# Altium schematic sheet WR-Clocks.SchDoc: =SheetTitle_Top
size 420 x 297 mm; EDA_Number: ARTIQ; Author: G.Kasprowicz; CompanyName: WUT ISE; DrawnBy: G.Kasprowicz; Organization: WUT ISE; Address1: PW ISE; Address2: Nowowiejska 15/19 00-665 Warsaw; Address3: gkasprow@gmail.com; ModifiedBy: -; CheckedDate: -; Title2: WR Clocks; DivGrp: WUT ISE; Designer: G.Kasprowicz; ModifiedDate: -; ProjectName: Sensor Box
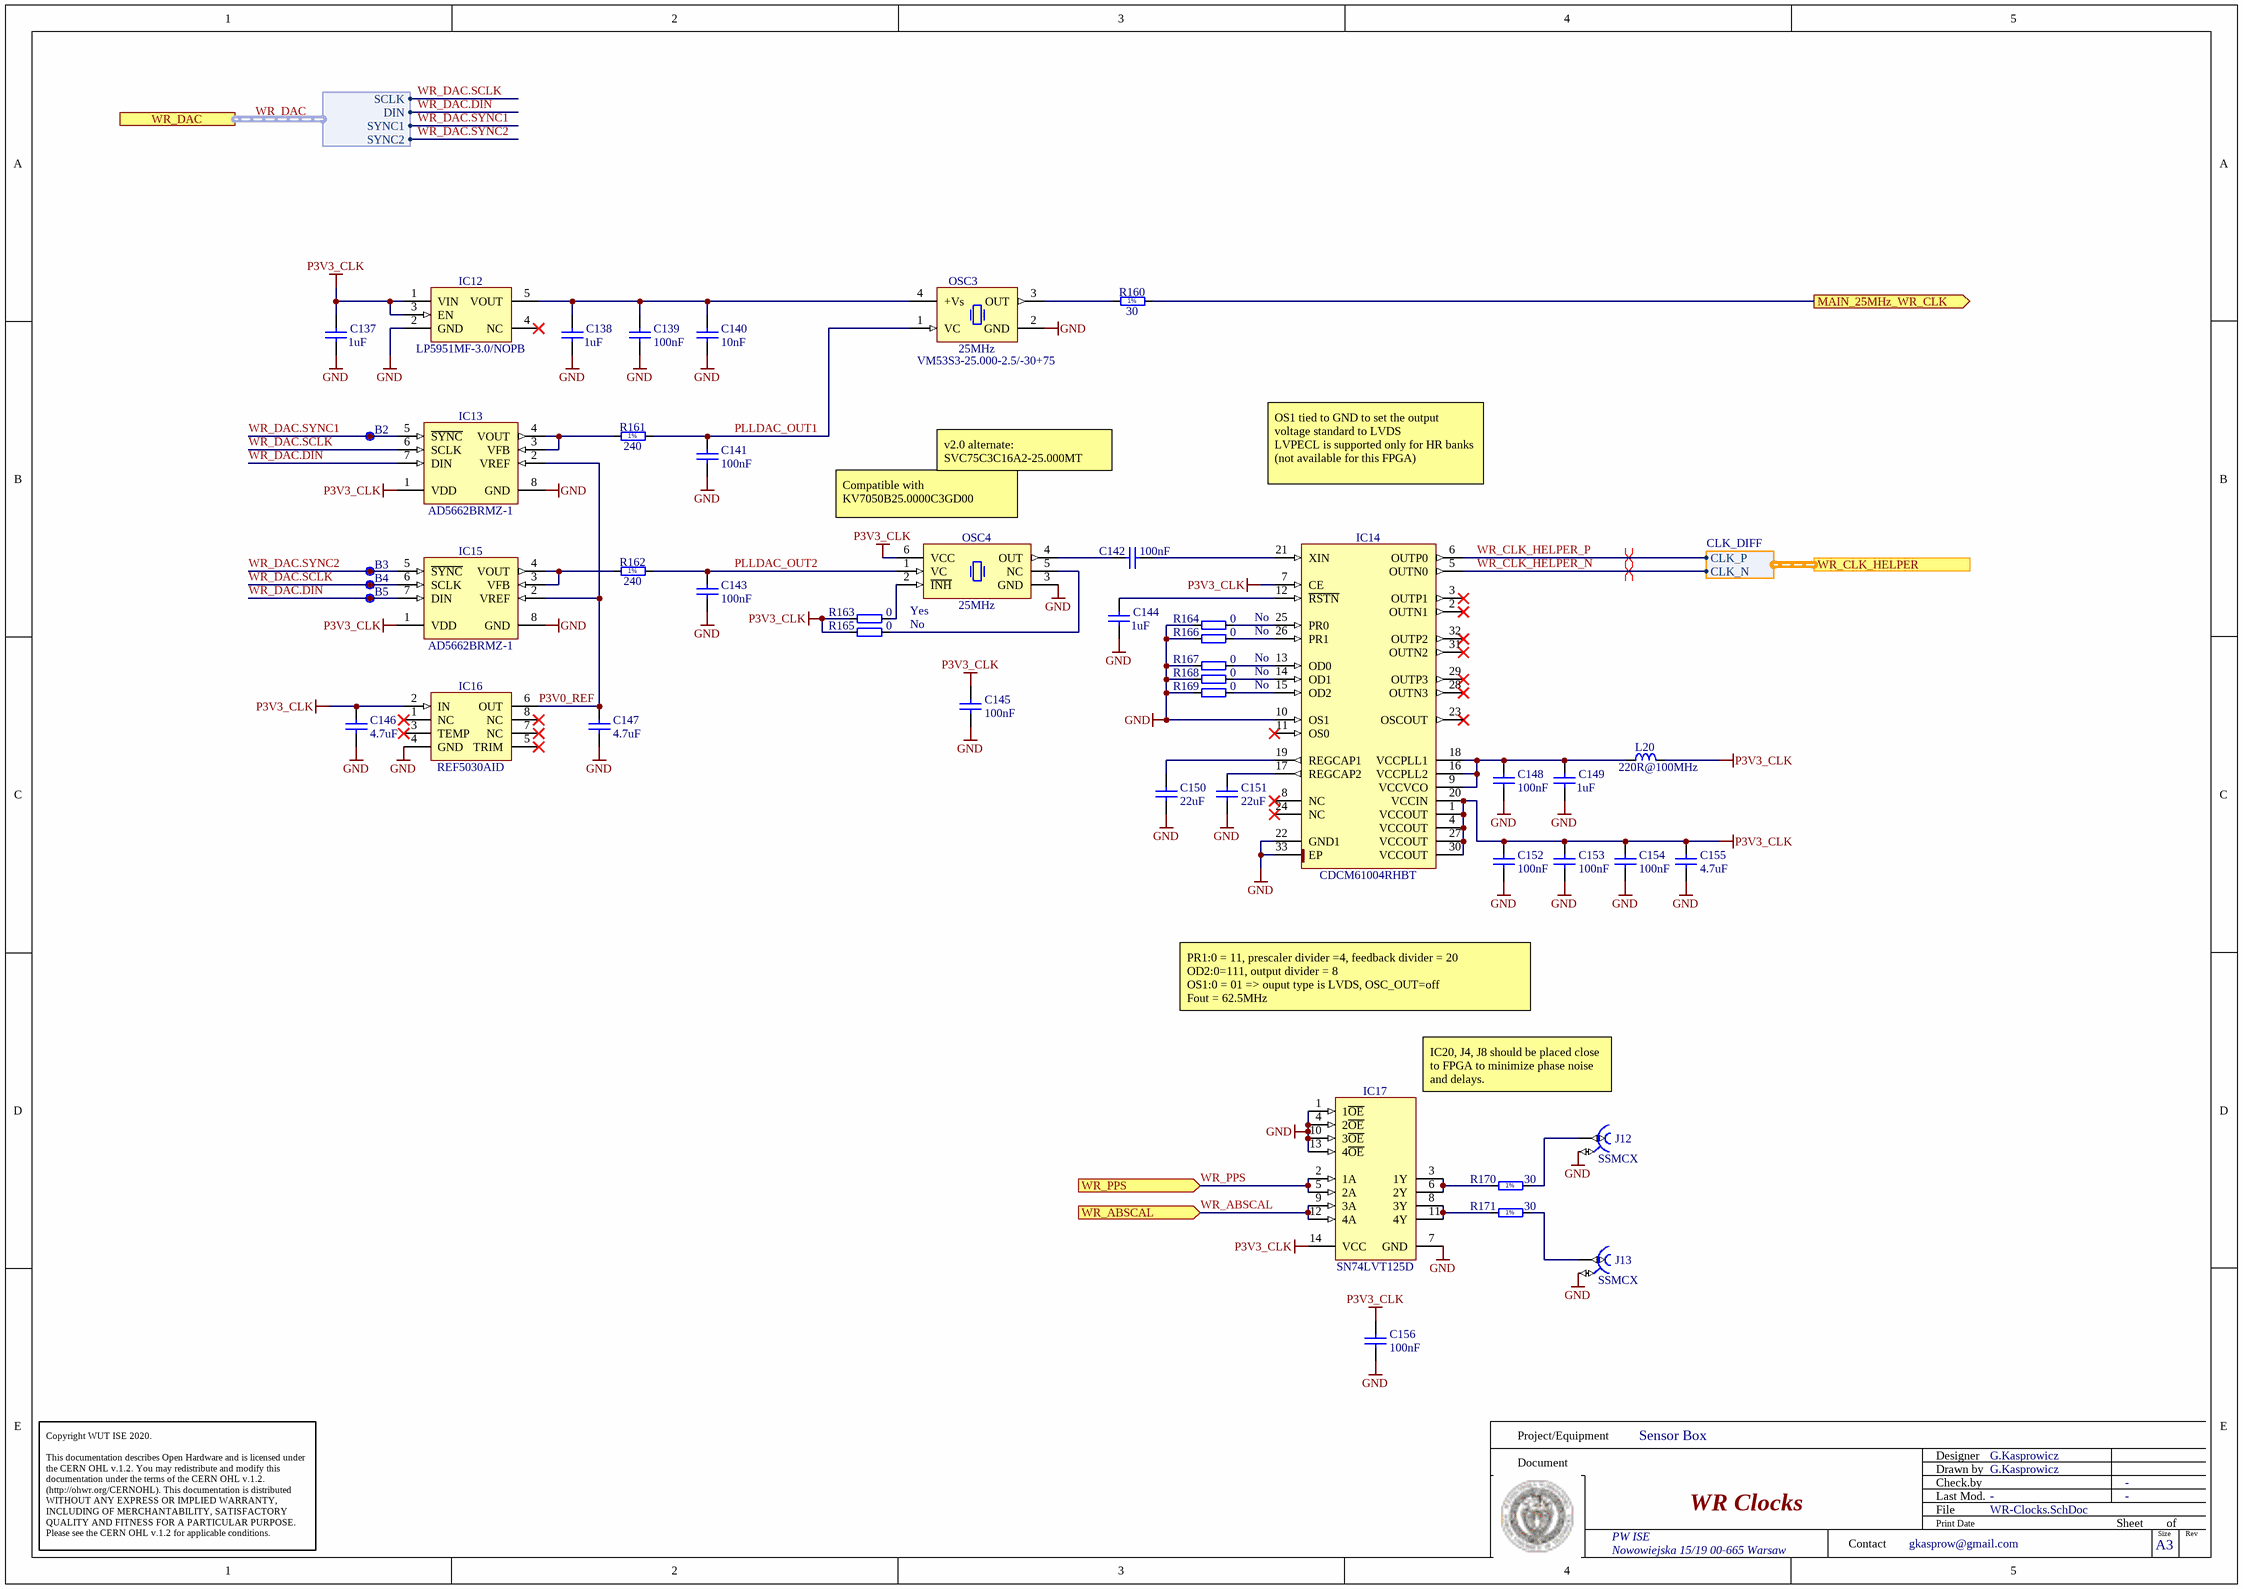
[diagram p0: WR-Clocks.SchDoc]

## Parts
B2  SMD Pad  [C100]  (value not drawn)  (no BOM)
B3  SMD Pad  [C100]  (value not drawn)  (no BOM)
B4  SMD Pad  [C100]  (value not drawn)  (no BOM)
B5  SMD Pad  [C100]  (value not drawn)  (no BOM)
C137  1uF  [CAPC1005X55N]
C138  1uF  [CAPC1005X55N]
C139  100nF  [CAPC1005X55N]
C140  10nF  [CAPC1005X55N]
C141  100nF  [CAPC1005X55N]
C142  100nF  [CAPC1005X55N]
C143  100nF  [CAPC1005X55N]
C144  1uF  [CAPC1005X55N]
C145  100nF  [CAPC1005X55N]
C146  4.7uF  [CAPC1005X55N]
C147  4.7uF  [CAPC1005X55N]
C148  100nF  [CAPC1005X55N]
C149  1uF  [CAPC1005X55N]
C150  22uF  [CAPC1709X100N]
C151  22uF  [CAPC1709X100N]
C152  100nF  [CAPC1005X55N]
C153  100nF  [CAPC1005X55N]
C154  100nF  [CAPC1005X55N]
C155  4.7uF  [CAPC1005X55N]
C156  100nF  [CAPC1005X55N]
IC12  LP5951MF-3.0/NOPB  [SOT95P284X122-5N]
IC13  AD5662BRMZ-1  [SOP65P490X110-8N]
IC14  CDCM61004RHBT  [QFN50P500X500X100-33N-S355]
IC15  AD5662BRMZ-1  [SOP65P490X110-8N]
IC16  REF5030AID  [SOIC127P600X175-8N]
IC17  SN74LVT125D  [SOIC127P600X175-14N]
J12  SSMCX  [MOLEX_73413-0040]
J13  SSMCX  [MOLEX_73413-0040]
L20  220R@100MHz  [INDC2012X105N]
OSC3  25MHz  Manufacturer Part Number: VM53S3-25.000-2.5/-30+75  [OSCCC320X500X160-4N]
OSC4  25MHz  [OSC_KYOCERA_KV7050B-C3]
R160  30  [RESC1005X40N]
R161  240  [RESC1005X40N]
R162  240  [RESC1005X40N]
R163  0  Mounted: Yes  [RESC1005X40N]
R164  0  Mounted: No  [RESC1005X40N]
R165  0  Mounted: No  [RESC1005X40N]
R166  0  Mounted: No  [RESC1005X40N]
R167  0  Mounted: No  [RESC1005X40N]
R168  0  Mounted: No  [RESC1005X40N]
R169  0  Mounted: No  [RESC1005X40N]
R170  30  [RESC1005X40N]
R171  30  [RESC1005X40N]

## Ports
MAIN_25MHz_WR_CLK (out), WR_ABSCAL (in), WR_CLK_HELPER (harness CLK_DIFF), WR_DAC (harness WR_DAC_H), WR_PPS (in)

## Harnesses
WR_DAC_H: SYNC1, SCLK, SYNC2, DIN
CLK_DIFF: CLK_P, CLK_N

## Nets
GND: C137.1 C138.1 C139.1 C140.1 C141.1 C143.1 C144.1 C145.1 C146.1 C147.1 C148.1 C149.1 C150.1 C151.1 C152.1 C153.1 C154.1 C155.1 C156.1 IC12.2(GND) IC13.8(GND) IC14.10(OS1) IC14.22(GND1) IC14.33(EP) IC15.8(GND) IC16.4(GND) IC17.1(1~{OE}) IC17.4(2~{OE}) IC17.7(GND) IC17.10(3~{OE}) IC17.13(4~{OE}) J12.2 J13.2 OSC3.2(GND) OSC4.3(GND) R164.1 R166.1 R167.1 R168.1 R169.1
P3V3_CLK: C137.2 C145.2 C146.2 C152.2 C153.2 C154.2 C155.2 C156.2 IC12.1(VIN) IC12.3(EN) IC13.1(VDD) IC14.1(VCCOUT) IC14.4(VCCOUT) IC14.7(CE) IC14.20(VCCIN) IC14.27(VCCOUT) IC14.30(VCCOUT) IC15.1(VDD) IC16.2(IN) IC17.14(VCC) L20.2 OSC4.6(VCC) R163.1 R165.1
MAIN_25MHz_WR_CLK: R160.2 ; port MAIN_25MHz_WR_CLK
P3V0_REF: C147.2 IC13.2(VREF) IC15.2(VREF) IC16.6(OUT)
PLLDAC_OUT1: C141.2 OSC3.1(VC) R161.2
PLLDAC_OUT2: C143.2 OSC4.1(VC) R162.2
WR_ABSCAL: IC17.9(3A) IC17.12(4A) ; port WR_ABSCAL
WR_CLK_HELPER_N: IC14.5(OUTN0) ; port WR_CLK_HELPER.CLK_N
WR_CLK_HELPER_P: IC14.6(OUTP0) ; port WR_CLK_HELPER.CLK_P
WR_DAC.DIN: B5.1 IC13.7(DIN) IC15.7(DIN) ; port WR_DAC.DIN
WR_DAC.SCLK: B4.1 IC13.6(SCLK) IC15.6(SCLK) ; port WR_DAC.SCLK
WR_DAC.SYNC1: B2.1 IC13.5(~{SYNC}) ; port WR_DAC.SYNC1
WR_DAC.SYNC2: B3.1 IC15.5(~{SYNC}) ; port WR_DAC.SYNC2
WR_PPS: IC17.2(1A) IC17.5(2A) ; port WR_PPS
NetC138_2: C138.2 C139.2 C140.2 IC12.5(VOUT) OSC3.4(+Vs)
NetC142_1: C142.1 IC14.21(XIN)
NetC142_2: C142.2 OSC4.4(OUT)
NetC144_2: C144.2 IC14.12(~{RSTN})
NetC148_2: C148.2 C149.2 IC14.9(VCCVCO) IC14.16(VCCPLL2) IC14.18(VCCPLL1) L20.1
NetC150_2: C150.2 IC14.19(REGCAP1)
NetC151_2: C151.2 IC14.17(REGCAP2)
NetIC13_3: IC13.3(VFB) IC13.4(VOUT) R161.1
NetIC14_13: IC14.13(OD0) R167.2
NetIC14_14: IC14.14(OD1) R168.2
NetIC14_15: IC14.15(OD2) R169.2
NetIC14_25: IC14.25(PR0) R164.2
NetIC14_26: IC14.26(PR1) R166.2
NetIC15_3: IC15.3(VFB) IC15.4(VOUT) R162.1
NetIC17_3: IC17.3(1Y) IC17.6(2Y) R170.1
NetIC17_8: IC17.8(3Y) IC17.11(4Y) R171.1
NetJ12_1: J12.1 R170.2
NetJ13_1: J13.1 R171.2
NetOSC3_3: OSC3.3(OUT) R160.1
NetOSC4_2: OSC4.2(~{INH}) R163.2
NetOSC4_5: OSC4.5(NC) R165.2

Not connected (* = marked no-connect by the designer): IC12 4(NC)*; IC14 2(OUTN1)* 3(OUTP1)* 8(NC)* 11(OS0)* 23(OSCOUT)* 24(NC)* 28(OUTN3)* 29(OUTP3)* 31(OUTN2)* 32(OUTP2)*; IC16 1(NC)* 3(TEMP)* 5(TRIM)* 7(NC)* 8(NC)*

## Buses and harness runs
harness WR_DAC = port WR_DAC

## Layout directives
differential pair: WR_CLK_HELPER_N, WR_CLK_HELPER_P

## Notes on the sheet
- (near OSC4) Compatible with KV7050B25.0000C3GD00
- v2.0 alternate: SVC75C3C16A2-25.000MT
- OS1 tied to GND to set the output voltage standard to LVDS
  LVPECL is supported only for HR banks (not available for this FPGA)
- PR1:0 = 11, prescaler divider =4, feedback divider = 20
  OD2:0=111, output divider = 8
  OS1:0 = 01 => ouput type is LVDS, OSC_OUT=off
  Fout = 62.5MHz
- (near IC17) IC20, J4, J8 should be placed close to FPGA to minimize phase noise and delays.
- Project/Equipment
- Document
- Designer
- Drawn by
- Check.by
- Copyright WUT ISE 2020.
  This documentation describes Open Hardware and is licensed under the CERN OHL v.1.2. You may redistribute and modify this documentation under the terms of the CERN OHL v.1.2. (http://ohwr.org/CERNOHL). This documentation is distributed WITHOUT ANY EXPRESS OR IMPLIED WARRANTY, INCLUDING OF MERCHANTABILITY, SATISFACTORY QUALITY AND FITNESS FOR A PARTICULAR PURPOSE. Please see the CERN OHL v.1.2 for applicable conditions.
- Contact
- File
- Last Mod.
- Print Date
- Sheet
- Size
- A3
- of
- Rev
- (in symbol R0402_30R_1%_0.0625W_100PPM) 1%
- (in symbol R0402_240R_1%_0.0625W_100PPM) 1%

## Library data of the parts
B2-B5 = SMD_PAD_D1MM: Through Hole Pad; Part Description: 1mm Diameter SMD Pad; Mounted: No; Part Number: SMD_PAD_D1MM; Component Type: Standard (No BOM); Pin Count: 1; Family: SMD Pad; Socket: No; SMD: No; Sense: No; Status: None; ComponentHeight: 0mm; HelpURL: Undefined; Author: CERN DEM JLC; CreateDate: 10.10.2017; LatestRevisionDate: 10.10.2017; PackageDescription: 1mm Diameter SMD Pad
C137 C138 C144 C149 = CC0402_1UF_16V_10%_X5R: Non-polarised capacitor; Part Description: SMD Multilayer Chip Ceramic Capacitor; Manufacturer: GENERIC; Manufacturer1 Part Number: C1005X5R1C105KT; Voltage: 16V; TC: X5R; Tolerance: ±10%; Part Number: CC0402_1UF_16V_10%_X5R; Component Kind: Standard; Component Type: Standard; Pin Count: 2; Value: 1uF; Status: Preferred; Manufacturer Part Number: CC0402_1UF_16V_10%_X5R; Case: 0402; Mounted: Yes; Socket: No; SMD: Yes; Sense: No; Manufacturer1 Example: TDK; Manufacturer1 ComponentHeight: 0.55mm; HelpURL: \\cern.ch\dfs\Applications\Altium\Datasheets\CC0402_X5R_TDK_C.pdf; Author: CERN DEM JLC; CreateDate: 2012-10-25; LatestRevisionDate: 2012-10-25
C139 C141-C143 C145 C148 C152-C154 C156 = CC0402_100NF_16V_10%_X5R: Non-polarised capacitor; Part Description: SMD Multilayer Chip Ceramic Capacitor; Manufacturer: GENERIC; Manufacturer1 Part Number: GRM155R61C104KA88D; Voltage: 16V; TC: X5R; Tolerance: ±10%; Part Number: CC0402_100NF_16V_10%_X5R; Component Kind: Standard; Component Type: Standard; Pin Count: 2; Value: 100nF; Status: None; Manufacturer Part Number: CC0402_100NF_16V_10%_X5R; Case: 0402; Mounted: Yes; Socket: No; SMD: Yes; Sense: No; Manufacturer1 Example: MURATA; Manufacturer1 ComponentHeight: 0.55mm; HelpURL: \\cern.ch\dfs\Applications\Altium\Datasheets\CC0402_X5R_MURATA_GRM.pdf; Author: CERN DEM JLC; CreateDate: 10.12.2013; LatestRevisionDate: 10.12.2013
C140 = CC0402_10NF_16V_10%_X7R: Non-polarised capacitor; Part Description: SMD Multilayer Chip Ceramic Capacitor; Manufacturer: GENERIC; Manufacturer1 Part Number: 223878715636; Voltage: 16V; TC: X7R; Tolerance: ±10%; Part Number: CC0402_10NF_16V_10%_X7R; Component Kind: Standard; Component Type: Standard; Pin Count: 2; Value: 10nF; Status: Not Recommended; Manufacturer Part Number: CC0402_10NF_16V_10%_X7R; Case: 0402; Mounted: Yes; Socket: No; SMD: Yes; Sense: No; Manufacturer1 Example: PHYCOMP; Manufacturer1 ComponentHeight: 0.55mm; HelpURL: \\cern.ch\dfs\Applications\Altium\Datasheets\CC0402_X7R_PHYCOMP.pdf; Author: CERN DEM JLC; CreateDate: 03.12.2007; LatestRevisionDate: 03.12.2007
C146 C147 C155 = CC0402_4.7UF_6.3V_20%_X5R: Non-polarised capacitor; Part Description: SMD Multilayer Chip Ceramic Capacitor; Manufacturer: GENERIC; Manufacturer1 Part Number: C1005X5R0J475M050BC; Voltage: 6.3V; TC: X5R; Tolerance: ±20%; Part Number: CC0402_4.7UF_6.3V_20%_X5R; Component Kind: Standard; Component Type: Standard; Pin Count: 2; Value: 4.7uF; Status: Preferred; Manufacturer Part Number: CC0402_4.7UF_6.3V_20%_X5R; Case: 0402; Mounted: Yes; Socket: No; SMD: Yes; Manufacturer1 Example: TDK; Manufacturer1 ComponentHeight: 0.65mm; HelpURL: \\cern.ch\dfs\Applications\Altium\Datasheets\CC0402_X5R_TDK_C.pdf; Author: CERN DEM JLC; CreateDate: 03-Mar-15; LatestRevisionDate: 03-Mar-15; Sense: No
C150 C151 = CC0603_22UF_6.3V_20%_X5R: Non-polarised capacitor; Part Description: SMD Multilayer Chip Ceramic Capacitor; Manufacturer: GENERIC; Manufacturer1 Part Number: C1608X5R0J226M080AC; Voltage: 6.3V; TC: X5R; Tolerance: ±20%; Part Number: CC0603_22UF_6.3V_20%_X5R; Component Kind: Standard; Component Type: Standard; Pin Count: 2; Value: 22uF; Status: None; Manufacturer Part Number: CC0603_22UF_6.3V_20%_X5R; Case: 0603; Mounted: Yes; Socket: No; SMD: Yes; Manufacturer1 Example: TDK; Manufacturer1 ComponentHeight: 1mm; HelpURL: \\cern.ch\dfs\Applications\Altium\Datasheets\CC0603_X5R_TDK_C.pdf; Author: CERN DEM JLC; CreateDate: 16-Dec-13; LatestRevisionDate: 13-Sep-16; Sense: No
IC12 = LP5951MF-3.0/NOPB: 150mA Micropower Low-Dropout CMOS Voltage Regulator; Part Description: 3V,  150mA Micropower Low-Dropout CMOS Voltage Regulator; Manufacturer: NATIONAL SEMICONDUCTOR; Table: Regulators; Article#: 16843; Placement Order ID: SMD_SOT&SOD; Part Number: LP5951MF-3.0/NOPB; Component Kind: Standard; Component Type: Standard; Device: LP5951MF-3.0/NOPB; PackageDescription: SOT23 5, Pitch 0.95mm - Body 1.67x2.99mm, IPC Medium Density; Manufacturer Part Number: LP5951MF-3.0/NOPB; Pin Count: 5; Case: SOT23-5; Mounted: Yes; Socket: No; SMD: Yes; ComponentHeight: 1.19mm; HelpURL: \\cern.ch\dfs\Applications\Altium\Datasheets\LP5951MF-3.0-NOPB.pdf; Author: CERN DEM JLC; CreateDate: 24/01/2011; LatestRevisionDate: 24/01/2011
IC13 IC15 = AD5662BRMZ-1: 2.7V to 5.5V, 250uA, Rail-to-Rail Output 16-Bit nanoDAC; Manufacturer: ANALOG DEVICES; Table: Analog & Interface; Article#: 16755; Placement Order ID: SMD_GULL_WING; Part Number: AD5662BRMZ-1; Component Kind: Standard; Component Type: Standard; Device: AD5662BRMZ-1; PackageDescription: SOP, 8-Leads, Body 3.0x3.0mm, Pitch 0.65mm, IPC Medium Density; Part Description: 2.7V to 5.5V, 250uA, Rail-to-Rail Output 16-Bit nanoDAC; Manufacturer Part Number: AD5662BRMZ-1; Pin Count: 8; Case: MSOP8; Mounted: Yes; Socket: No; SMD: Yes; ComponentHeight: 1.1mm; Author: CERN DEM JLC; HelpURL: \\cern.ch\dfs\Applications\Altium\Datasheets\AD5662BRMZ-1.pdf; CreateDate: 1/10/2011; LatestRevisionDate: 1/10/2011
IC14 = CDCM61004RHBT: Four Output, Integrated VCO, Low-Jitter Clock Generator; Manufacturer: TEXAS INSTRUMENTS; Table: Logic; Article#: 16910; Placement Order ID: SMD_PASTE; Part Number: CDCM61004RHBT; Component Kind: Standard; Component Type: Standard; Device: CDCM61004RHBT; PackageDescription: QFN, (MO-220-VHHD-4) 0.50mm pitch,square; 8 pin X 8 pin, 5mm X 5mm X 1.00mm H body (w/thermal tab 3.5 X 3.5mm),  IPC Medium Density; Part Description: Four Output, Integrated VCO, Low-Jitter Clock Generator; Manufacturer Part Number: CDCM61004RHBT; Pin Count: 33; Case: QFN32; Mounted: Yes; Socket: No; SMD: Yes; ComponentHeight: 1mm; HelpURL: \\cern.ch\dfs\Applications\Altium\Datasheets\CDCM61004RHBT.pdf; Author: CERN DEM JLC; CreateDate: 25/08/2010; LatestRevisionDate: 21/11/2011
IC16 = REF5030AID: Low-Noise, Very Low Drift, Precision Voltage Reference; Part Description: 3V, Low-Noise, Very Low Drift, Precision Voltage Reference; Manufacturer: TEXAS INSTRUMENTS; PressFit: No; Bonding: No; Part Number: REF5030AID; Component Kind: Standard; Component Type: Standard; Device: REF5030AID; PackageDescription: SOIC 8, Pitch 1.27mm, Body 4x5mm, IPC Medium Density; Manufacturer Part Number: REF5030AID; Pin Count: 8; Case: SOIC8; Mounted: Yes; Socket: No; SMD: Yes; ComponentHeight: 1.75mm; HelpURL: \\cern.ch\dfs\Applications\Altium\Datasheets\REF5030AID.pdf; Author: CERN DEM MR; CreateDate: 14-Oct-16; LatestRevisionDate: 14-Oct-16; Sense: No
IC17 = SN74LVT125D: Quadruple Bus Buffer with 3-State Outputs; Part Description: 3.3V ABT Quadruple Bus Buffer with 3-State Outputs; Manufacturer: TEXAS INSTRUMENTS; PressFit: No; Bonding: No; Part Number: SN74LVT125D; Component Kind: Standard; Component Type: Standard; Device: SN74LVT125D; PackageDescription: SOIC 14, Pitch 1.27mm - Body 4x8.75mm, IPC Medium Density; Manufacturer Part Number: SN74LVT125D; Pin Count: 14; Case: SOIC14; Mounted: Yes; Socket: No; SMD: Yes; Sense: No; ComponentHeight: 1.75mm; Author: CERN DEM JLC; HelpURL: \\cern.ch\dfs\Applications\Altium\Datasheets\SN74LVT125D.pdf; CreateDate: 01-Jun-11; LatestRevisionDate: 01-Jun-11
J12 J13 = MOLEX_73413-0040: Part Description: 50 Ohm, Magnetic Vertical SSMCX Jack; Manufacturer: MOLEX; PressFit: No; Part Number: MOLEX_73413-0040; Component Kind: Standard; Component Type: Standard; Pin Count: 2; Family: SSMCX; Mounted: Yes; Socket: No; SMD: Yes; Sense: No; Status: None; Manufacturer Part Number: 73413-0040; ComponentHeight: 3.35mm; HelpURL: \\cern.ch\dfs\Applications\Altium\Datasheets\MOLEX_73413-0040.pdf; Author: CERN DEM JLC; CreateDate: 31-May-17; LatestRevisionDate: 29-Jan-18
L20 = IND0805_MURATA_BLM21PG221SN1D: Inductor; Part Description: SMD EMIFIL Suppression Chip Ferrite Bead; Manufacturer: MURATA; Power: 2A; Resistance: 0.05R; Tolerance: ±25%; Table: Inductors SMD; Part Number: IND0805_MURATA_BLM21PG221SN1D; Component Kind: Standard; Component Type: Standard; Pin Count: 2; Value: 220R@100MHz; Status: None; Manufacturer Part Number: BLM21PG221SN1D; Case: 0805; Mounted: Yes; Socket: No; SMD: Yes; ComponentHeight: 1.05mm; HelpURL: \\cern.ch\dfs\Applications\Altium\Datasheets\IND0402_MURATA_BLM21P.pdf; Author: CERN DEM JLC; CreateDate: 25/01/2010; LatestRevisionDate: 25/01/2010
OSC3 = OSC_25MHZ_MERCURY_VM53S3-25.000-2.5/-30+75: Oscillator 4 pins 1=VC 2=GND 3=OUT 4=+Vs; Part Description: 3V ±2.5ppmVoltage Controlled Temperature Compensated Crystal Oscillator VM53S3 Serie; Manufacturer: MERCURY ELECTRONICS; Table: Crystals & Oscillators; Article#: 16765; Placement Order ID: SMD_LEADLESS; Part Number: OSC_25MHZ_MERCURY_VM53S3-25.000-2.5/-30+75; Component Kind: Standard; Component Type: Standard; PackageDescription: SMD Oscillator, Corner Convave, 4 pins, 5x3.2mm; Value: 25MHz; Pin Count: 4; Mounted: Yes; Socket: No; SMD: Yes; ComponentHeight: 1.6mm; HelpURL: \\cern.ch\dfs\Applications\Altium\Datasheets\OSC_MERCURY_VM53S3.pdf; Author: CERN DEM JLC; CreateDate: 1/20/2010; LatestRevisionDate: 1/24/2011
OSC4 = OSC_25MHZ_KYOCERA_KV7050B25.0000C3GD00: Oscillator KYOCERA; Part Description: ±50ppm, 15pF, Supply Voltage 3.3V, -40°C to +85°C, Surface Mount Crystal Oscillator VCXO, KV7050B-C3 Series; PressFit: No; Bonding: No; Part Number: OSC_25MHZ_KYOCERA_KV7050B25.0000C3GD00; Component Kind: Standard; Component Type: Standard; PackageDescription: SMD Crystal Kyocera, 6 Pin, 7mm L X 5mm W X 1.6mm H; Value: 25MHz; Manufacturer: KYOCERA; Manufacturer Part Number: KV7050B25.0000C3GD00; Pin Count: 6; Mounted: Yes; Socket: No; SMD: Yes; Sense: No; ComponentHeight: 1.6mm; HelpURL: \\cern.ch\dfs\Applications\Altium\Datasheets\OSC_KYOCERA_KV7050B-C3.pdf; Author: CERN DEM MR; CreateDate: 01.10.2019; LatestRevisionDate: 01.10.2019
R160 R170 R171 = R0402_30R_1%_0.0625W_100PPM: Resistor - 1%; Part Description: General Purpose Thick Film Chip Resistor; Manufacturer: GENERIC; Manufacturer1 Part Number: 232270673009L; TC: ±100ppm/°C; PressFit: No; Part Number: R0402_30R_1%_0.0625W_100PPM; Component Kind: Standard; Component Type: Standard; Pin Count: 2; Value: 30; Status: Not Recommended; Power: 0.0625W; Tolerance: ±1%; Manufacturer Part Number: R0402_30R_1%_0.0625W_100PPM; Case: 0402; Mounted: Yes; Socket: No; SMD: Yes; Manufacturer1 Example: YAGEO PHYCOMP; Manufacturer1 ComponentHeight: 0.4mm; HelpURL: \\cern.ch\dfs\Applications\Altium\Datasheets\R0402_Phycomp_RC0402.pdf; Author: CERN DEM JLC; CreateDate: 03/12/2007; LatestRevisionDate: 17/10/2012; Sense: No
R161 R162 = R0402_240R_1%_0.0625W_100PPM: Resistor - 1%; Part Description: General Purpose Thick Film Chip Resistor; Manufacturer: GENERIC; Manufacturer1 Part Number: 232270672401L; TC: ±100ppm/°C; PressFit: No; Part Number: R0402_240R_1%_0.0625W_100PPM; Component Kind: Standard; Component Type: Standard; Pin Count: 2; Value: 240; Status: Not Recommended; Power: 0.0625W; Tolerance: ±1%; Manufacturer Part Number: R0402_240R_1%_0.0625W_100PPM; Case: 0402; Mounted: Yes; Socket: No; SMD: Yes; Manufacturer1 Example: YAGEO PHYCOMP; Manufacturer1 ComponentHeight: 0.4mm; HelpURL: \\cern.ch\dfs\Applications\Altium\Datasheets\R0402_Phycomp_RC0402.pdf; Author: CERN DEM JLC; CreateDate: 03-Dec-07; LatestRevisionDate: 17-Oct-12; Sense: No
R163-R169 = R0402_0R_JUMPER: Resistor; Part Description: 1A (0.05R Max DC Resistance) Zero Ohm Jumper; Manufacturer: GENERIC; Manufacturer1 Part Number: 232270591001L; PressFit: No; Part Number: R0402_0R_JUMPER; Component Kind: Standard; Component Type: Standard; Pin Count: 2; Value: 0; Status: Not Recommended; Manufacturer Part Number: R0402_0R_JUMPER; Case: 0402; Sense: No; Socket: No; SMD: Yes; Manufacturer1 Example: YAGEO PHYCOMP; Manufacturer1 ComponentHeight: 0.4mm; HelpURL: \\cern.ch\dfs\Applications\Altium\Datasheets\R0402_Phycomp_RC0402.pdf; Author: CERN DEM JLC; CreateDate: 03.12.2007; LatestRevisionDate: 17.10.2012